# Altium schematic sheet mainPower.SchDoc
size A4
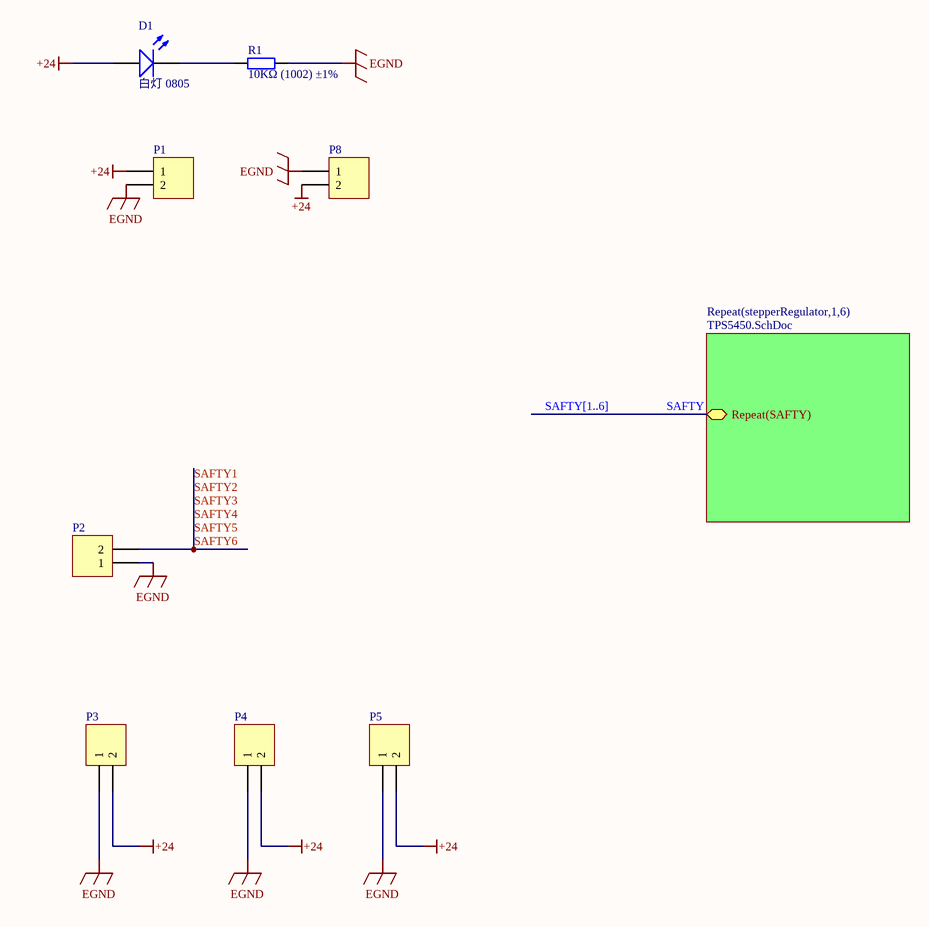
[diagram p0: mainPower.SchDoc]

## Parts
D1  白灯 0805  [0805_LED_S1]
P1  Header 2  [5.08-2P]  (value not drawn)
P2  Header 2  [5.08-2P]  (value not drawn)
P3  Header 2  [XH-2A]  (value not drawn)
P4  Header 2  [XH-2A]  (value not drawn)
P5  Header 2  [XH-2A]  (value not drawn)
P8  Header 2  [5.08-2P]  (value not drawn)
R1  10KΩ (1002) ±1%  [0805_R]

## Sub-sheets
Repeat(stepperRegulator,1,6) = TPS5450.SchDoc: Repeat(SAFTY)

## Nets
+24: D1.A P1.1 P3.2 P4.2 P5.2 P8.2
EGND: P1.2 P2.1 P3.1 P4.1 P5.1 P8.1 R1.2
SAFTY: sheet Repeat(stepperRegulator,1,6)/Repeat(SAFTY)
SAFTY1: P2.2  [also labelled SAFTY2, SAFTY3, SAFTY4, SAFTY5, SAFTY6]
NetD1_K: D1.K R1.1

## Buses and harness runs
bus SAFTY[1..6]

## Library data of the parts
D1 = 0805 白灯: 发光二极管; ComponentLink1Description: 供应商链接; ComponentLink1URL: http://www.szlcsc.com/product/details_35468.html; Package: 0805; Supplier: LC; SuppliersPartNumber: C34499
P1-P5 P8 = Header 2: Header, 2-Pin; LatestRevisionDate: 17-Jul-2002; LatestRevisionNote: Re-released for DXP Platform.; Publisher: Altium Limited
R1 = 0805 10KΩ (1002) 1%: 贴片电阻; ComponentLink1Description: 供应商链接; ComponentLink1URL: http://www.szlcsc.com/product/details_18102.html; Package: 0805; Supplier: LC; SuppliersPartNumber: C17414